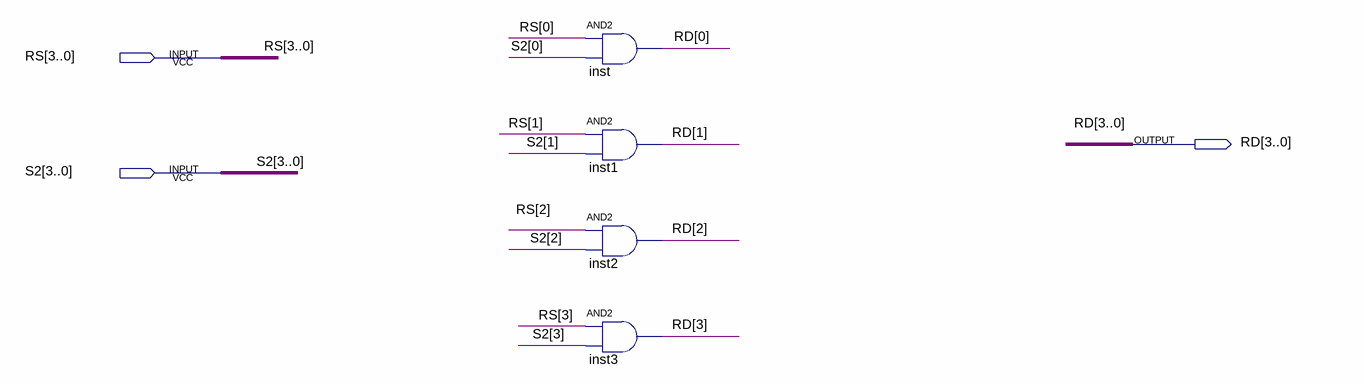
[diagram p0: schematic sheet]
// Quartus schematic Group03_2023510056_ALU_AND.bdf as structural Verilog: 4 symbols, 3 pins
module Group03_2023510056_ALU_AND (
  input  [3:0] RS,
  input  [3:0] S2,
  output [3:0] RD
);

  and inst (RD[0], RS[0], S2[0]);
  and inst1 (RD[1], RS[1], S2[1]);
  and inst2 (RD[2], RS[2], S2[2]);
  and inst3 (RD[3], RS[3], S2[3]);
endmodule
